# Altium schematic sheet BopITSchematic.SchDoc
size A; SheetNumber: 1; SheetTotal: 1
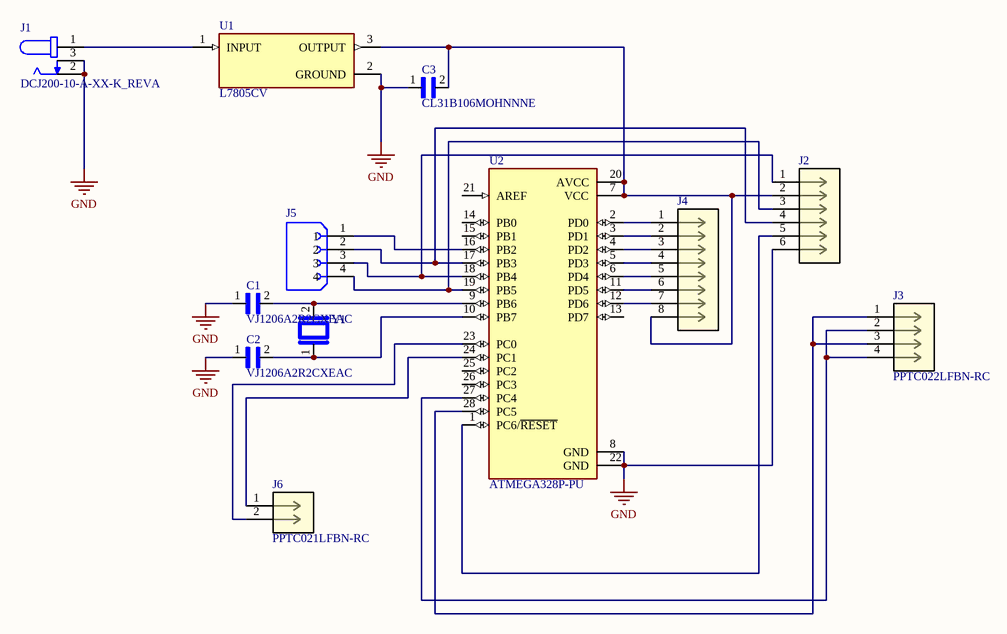
[diagram p0: BopITSchematic.SchDoc]

## Parts
C1  VJ1206A2R2CXEAC  [CAPC3216X170N]
C2  VJ1206A2R2CXEAC  [CAPC3216X170N]
C3  CL31B106MOHNNNE  [CAPC3216X140N]
J1  DCJ200-10-A-XX-K_REVA  [GCT_DCJ200-10-A-XX-K_REVA]
J2  61300621121  [CONN06_6130_7P62X5P08_WRE]  (value not drawn)
J3  PPTC022LFBN-RC  [CONN_PPTC022LFBN-RC_SUL]
J4  PPTC081LFBN-RC  [CONN_PPTC081LFBN-RC_SUL]  (value not drawn)
J5  PPTC041LFBN-RC  [SULLINS_PPTC041LFBN-RC]  (value not drawn)
J6  PPTC021LFBN-RC  [CONN2_LFBN-RC_SUL]
U1  L7805CV  [TO255P1040X460X1968-3]
U2  ATMEGA328P-PU  [DIP794W46P254L2967H457Q28B]
Y1  HC-49/U-S16000000ABJB  [XTAL_HC49P488W43L1150T466H350]  (value not drawn)

## Nets
GND: C1.1 C2.1 C3.1 J1.2 J1.3 J2.6 U1.2(GROUND) U2.8(GND) U2.22(GND)
NetC1_2: C1.2 U2.9(PB6) Y1.2
NetC2_2: C2.2 U2.10(PB7) Y1.1
NetC3_2: C3.2 J2.2 J4.8 U1.3(OUTPUT) U2.7(VCC) U2.20(AVCC)
NetJ1_1: J1.1 U1.1(INPUT)
NetJ2_1: J2.1 J5.3 U2.18(PB4)
NetJ2_3: J2.3 J5.4 U2.19(PB5)
NetJ2_4: J2.4 J5.2 U2.17(PB3)
NetJ2_5: J2.5 U2.1(PC6/~{RESET})
NetJ3_1: J3.1 J3.3 U2.28(PC5)
NetJ3_2: J3.2 J3.4 U2.27(PC4)
NetJ4_1: J4.1 U2.2(PD0)
NetJ4_2: J4.2 U2.3(PD1)
NetJ4_3: J4.3 U2.4(PD2)
NetJ4_4: J4.4 U2.5(PD3)
NetJ4_5: J4.5 U2.6(PD4)
NetJ4_6: J4.6 U2.11(PD5)
NetJ4_7: J4.7 U2.12(PD6)
NetJ5_1: J5.1 U2.16(PB2)
NetJ6_1: J6.1 U2.24(PC1)
NetJ6_2: J6.2 U2.23(PC0)

Not connected (* = marked no-connect by the designer): U2 13(PD7) 14(PB0) 15(PB1) 21(AREF) 25(PC2) 26(PC3)

## Library data of the parts
J1 = DCJ200-10-A-XX-K_REVA: Power Barrel Connector Jack 2.05mm ID (0.081), 5.50mm OD (0.217) Through Hole, Right Angle; MF: Global Connector Technology; MP: DCJ200-10-A-K1-K; SnapEDA_Link: https://www.snapeda.com/parts/DCJ200-10-A-K1-K/Global+Connector+Technology/view-part/?ref=snap; Package: None; Value: *; Check_prices: https://www.snapeda.com/parts/DCJ200-10-A-K1-K/Global+Connector+Technology/view-part/?ref=eda
J2 = 61300621121: No Description Available; Mfr_Name: Wurth Electronics; RefDes: RefDes; Type: Type
J3 = PPTC022LFBN-RC: No Description Available; Mfr_Name: Sullins; RefDes: RefDes; Type: Type
J4 = PPTC081LFBN-RC: No Description Available; Mfr_Name: Sullins; RefDes: RefDes; Type: Type
J5 = PPTC041LFBN-RC: 4 Position Header Connector 0.100 (2.54mm) Through Hole Tin; MF: Sullins Connector; Purchase-URL: https://pricing.snapeda.com/search/part/PPTC041LFBN-RC/?ref=eda; Check_prices: https://www.snapeda.com/parts/PPTC041LFBN-RC/Sullins+Connector+Solutions/view-part/?ref=eda; Package: None; SnapEDA_Link: https://www.snapeda.com/parts/PPTC041LFBN-RC/Sullins+Connector+Solutions/view-part/?ref=snap; Value: *; MP: PPTC041LFBN-RC; Digi-Key_Part_Number: S7002-ND
J6 = PPTC021LFBN-RC: No Description Available; Mfr_Name: Sullins; RefDes: RefDes; Type: Type
U1 = L7805CV: Linear Voltage Regulator IC Positive Fixed 1 Output 1.5A TO-220; MF: STMicroelectronics; SnapEDA_Link: https://www.snapeda.com/parts/L7805CV/STMicroelectronics/view-part/?ref=snap; Package: TO-220-3 ON Semiconductor; MP: L7805CV; Check_prices: https://www.snapeda.com/parts/L7805CV/STMicroelectronics/view-part/?ref=eda; Purchase-URL: https://pricing.snapeda.com/search/part/L7805CV/?ref=eda; Price: None; Value: *; Availability: In Stock
U2 = ATMEGA328P-PU: ATmega Series 20 MHz 32 KB Flash 2 KB SRAM 8-Bit Microcontroller - DIP-28; MP: ATMEGA328P-PU; Package: None; Availability: Unavailable; Price: None; Value: *
Y1 = HC-49/U-S16000000ABJB: 16 MHz Â±30ppm Crystal 18pF 50 Ohms HC-49/US; MF: Citizen Finedevice Co Ltd; Value: *; SnapEDA_Link: https://www.snapeda.com/parts/HC-49/U-S16000000ABJB/Citizen+Finedevice+Co+Ltd/view-part/?ref=snap; Purchase-URL: https://pricing.snapeda.com/search/part/HC-49/U-S16000000ABJB/?ref=eda; Availability: In Stock; Price: None; Package: HC-49/US Citizen Finetech Miyota; Check_prices: https://www.snapeda.com/parts/HC-49/U-S16000000ABJB/Citizen+Finedevice+Co+Ltd/view-part/?ref=eda; MP: HC-49/U-S16000000ABJB
C1 C2 = VJ1206A2R2CXEAC: Package: None; Price: None; Value: *; MP: VJ1206A2R2CXEAC; Availability: Unavailable
C3 = CL31B106MOHNNNE: Package: None; Price: None; Value: *; MP: CL31B106MOHNNNE; Availability: Unavailable